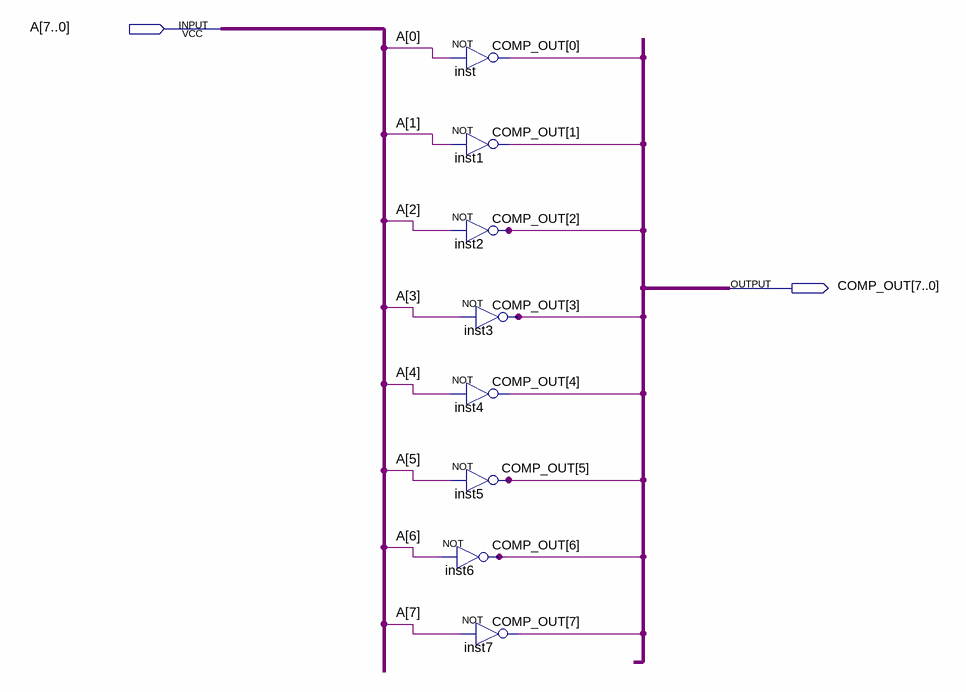
[diagram p0: schematic sheet]
// Quartus schematic COMP.bdf as structural Verilog: 8 symbols, 2 pins
module COMP (
  input  [7:0] A,
  output [7:0] COMP_OUT
);

  not inst (COMP_OUT[0], A[0]);
  not inst1 (COMP_OUT[1], A[1]);
  not inst2 (COMP_OUT[2], A[2]);
  not inst4 (COMP_OUT[4], A[4]);
  not inst5 (COMP_OUT[5], A[5]);
  not inst6 (COMP_OUT[6], A[6]);
  not inst3 (COMP_OUT[3], A[3]);
  not inst7 (COMP_OUT[7], A[7]);
endmodule
